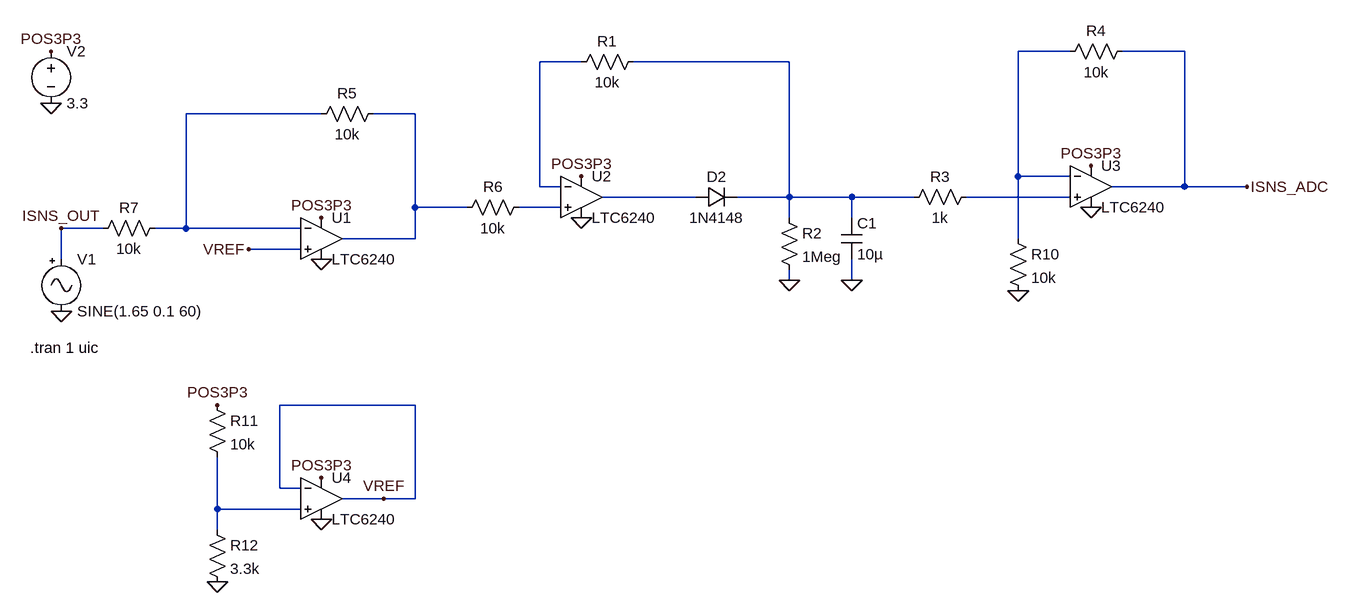
[diagram p0: schematic Signal_Conditioning.asc]
Signal_Conditioning.asc, the LTspice schematic file:
Version 4
SHEET 1 1720 724
WIRE 1312 -112 1232 -112
WIRE 1488 -112 1392 -112
WIRE 560 -96 496 -96
WIRE 880 -96 640 -96
WIRE 160 -16 -48 -16
WIRE 304 -16 240 -16
WIRE 1232 80 1232 -112
WIRE 1312 80 1232 80
WIRE 496 96 496 -96
WIRE 528 96 496 96
WIRE 1488 96 1488 -112
WIRE 1488 96 1376 96
WIRE 1584 96 1488 96
WIRE 736 112 592 112
WIRE 880 112 880 -96
WIRE 880 112 800 112
WIRE 976 112 880 112
WIRE 1072 112 976 112
WIRE 1312 112 1152 112
WIRE 304 128 304 -16
WIRE 384 128 304 128
WIRE 528 128 464 128
WIRE 880 144 880 112
WIRE 976 144 976 112
WIRE -176 160 -240 160
WIRE -48 160 -48 -16
WIRE -48 160 -96 160
WIRE 128 160 -48 160
WIRE 304 176 304 128
WIRE 304 176 192 176
WIRE 1232 176 1232 80
WIRE 128 192 48 192
WIRE -240 208 -240 160
WIRE 880 240 880 224
WIRE 976 240 976 208
WIRE 304 432 96 432
WIRE 96 560 96 432
WIRE 128 560 96 560
WIRE 256 576 192 576
WIRE 304 576 304 432
WIRE 304 576 256 576
WIRE 0 592 0 512
WIRE 128 592 0 592
WIRE 0 624 0 592
FLAG 160 208 0
FLAG -240 288 0
FLAG -256 -32 0
FLAG -256 -112 POS3P3
FLAG 160 144 POS3P3
FLAG 560 144 0
FLAG 560 80 POS3P3
FLAG 880 240 0
FLAG 976 240 0
FLAG 1344 128 0
FLAG 1344 64 POS3P3
FLAG 48 192 VREF
FLAG 1232 256 0
FLAG 1584 96 ISNS_ADC
FLAG -240 160 ISNS_OUT
FLAG 160 608 0
FLAG 160 544 POS3P3
FLAG 0 704 0
FLAG 0 432 POS3P3
FLAG 256 576 VREF
SYMBOL Misc\\signal -240 192 R0
WINDOW 123 0 0 Left 2
WINDOW 39 0 0 Left 2
SYMATTR InstName V1
SYMATTR Value SINE(1.65 0.1 60)
SYMBOL voltage -256 -128 R0
SYMATTR InstName V2
SYMATTR Value 3.3
SYMBOL diode 736 128 R270
WINDOW 0 32 32 VTop 2
WINDOW 3 0 32 VBottom 2
SYMATTR InstName D2
SYMATTR Value 1N4148
SYMBOL Opamps\\LTC6240 160 176 R0
SYMATTR InstName U1
SYMBOL res 480 112 R90
WINDOW 0 0 56 VBottom 2
WINDOW 3 32 56 VTop 2
SYMATTR InstName R6
SYMATTR Value 10k
SYMBOL Opamps\\LTC6240 560 112 R0
SYMATTR InstName U2
SYMBOL res 656 -112 R90
WINDOW 0 0 56 VBottom 2
WINDOW 3 32 56 VTop 2
SYMATTR InstName R1
SYMATTR Value 10k
SYMBOL res 864 128 R0
SYMATTR InstName R2
SYMATTR Value 1Meg
SYMBOL cap 960 144 R0
SYMATTR InstName C1
SYMATTR Value 10µ
SYMBOL res 1168 96 R90
WINDOW 0 0 56 VBottom 2
WINDOW 3 32 56 VTop 2
SYMATTR InstName R3
SYMATTR Value 1k
SYMBOL Opamps\\LTC6240 1344 96 R0
SYMATTR InstName U3
SYMBOL res 1408 -128 R90
WINDOW 0 0 56 VBottom 2
WINDOW 3 32 56 VTop 2
SYMATTR InstName R4
SYMATTR Value 10k
SYMBOL res 256 -32 R90
WINDOW 0 0 56 VBottom 2
WINDOW 3 32 56 VTop 2
SYMATTR InstName R5
SYMATTR Value 10k
SYMBOL res -80 144 R90
WINDOW 0 0 56 VBottom 2
WINDOW 3 32 56 VTop 2
SYMATTR InstName R7
SYMATTR Value 10k
SYMBOL res 1216 160 R0
SYMATTR InstName R10
SYMATTR Value 10k
SYMBOL Opamps\\LTC6240 160 576 R0
SYMATTR InstName U4
SYMBOL res -16 416 R0
SYMATTR InstName R11
SYMATTR Value 10k
SYMBOL res -16 608 R0
SYMATTR InstName R12
SYMATTR Value 3.3k
TEXT -288 344 Left 2 !.tran 1 uic

The netlist it stands for:
* Signal_Conditioning.asc
V1 ISNS_OUT 0 SINE(1.65 0.1 60)
V2 POS3P3 0 3.3
D2 N006 N003 1N4148
* U1: LTC6240 (symbol Opamps\LTC6240 not available, pins judged from their places): In+=VREF In-=N004 V+=POS3P3 V-=0 OUT=N005
R6 N008 N005 10k
* U2: LTC6240 (symbol Opamps\LTC6240 not available, pins judged from their places): In+=N008 In-=N002 V+=POS3P3 V-=0 OUT=N006
R1 N003 N002 10k
R2 N003 0 1Meg
C1 N003 0 10µ
R3 N007 N003 1k
* U3: LTC6240 (symbol Opamps\LTC6240 not available, pins judged from their places): In+=N007 In-=N001 V+=POS3P3 V-=0 OUT=ISNS_ADC
R4 ISNS_ADC N001 10k
R5 N005 N004 10k
R7 N004 ISNS_OUT 10k
R10 N001 0 10k
* U4: LTC6240 (symbol Opamps\LTC6240 not available, pins judged from their places): In+=N009 In-=VREF V+=POS3P3 V-=0 OUT=VREF
R11 POS3P3 N009 10k
R12 N009 0 3.3k
.model D D
.lib standard.dio
.tran 1 uic
.backanno
.end